# Altium schematic sheet Schematic_Ledtraitim.SchDoc
size A; SheetNumber: 1; SheetTotal: 1
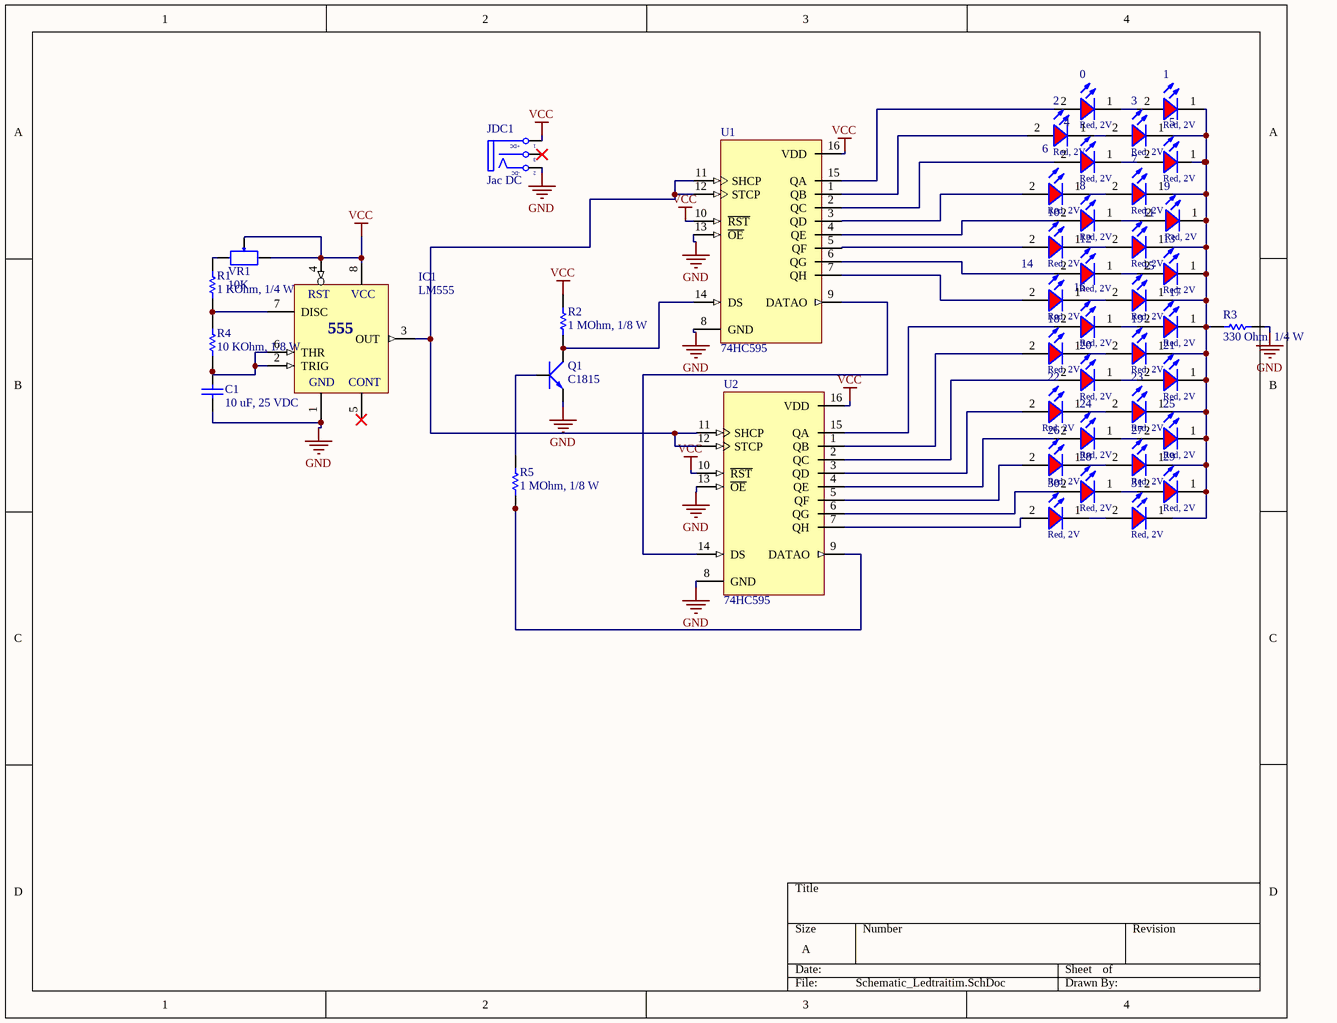
[diagram p0: Schematic_Ledtraitim.SchDoc]

## Parts
0  Red, 2V  [WL-SMCW_0805]
1  Red, 2V  [WL-SMCW_0805]
2  Red, 2V  [WL-SMCW_0805]
3  Red, 2V  [WL-SMCW_0805]
4  Red, 2V  [WL-SMCW_0805]
5  Red, 2V  [WL-SMCW_0805]
6  Red, 2V  [WL-SMCW_0805]
7  Red, 2V  [WL-SMCW_0805]
8  Red, 2V  [WL-SMCW_0805]
9  Red, 2V  [WL-SMCW_0805]
10  Red, 2V  [WL-SMCW_0805]
11  Red, 2V  [WL-SMCW_0805]
12  Red, 2V  [WL-SMCW_0805]
13  Red, 2V  [WL-SMCW_0805]
14  Red, 2V  [WL-SMCW_0805]
15  Red, 2V  [WL-SMCW_0805]
16  Red, 2V  [WL-SMCW_0805]
17  Red, 2V  [WL-SMCW_0805]
18  Red, 2V  [WL-SMCW_0805]
19  Red, 2V  [WL-SMCW_0805]
20  Red, 2V  [WL-SMCW_0805]
21  Red, 2V  [WL-SMCW_0805]
22  Red, 2V  [WL-SMCW_0805]
23  Red, 2V  [WL-SMCW_0805]
24  Red, 2V  [WL-SMCW_0805]
25  Red, 2V  [WL-SMCW_0805]
26  Red, 2V  [WL-SMCW_0805]
27  Red, 2V  [WL-SMCW_0805]
28  Red, 2V  [WL-SMCW_0805]
29  Red, 2V  [WL-SMCW_0805]
30  Red, 2V  [WL-SMCW_0805]
31  Red, 2V  [WL-SMCW_0805]
C1  10 uF, 25 VDC  [CAP_0805]
IC1  LM555  [DIP8]
JDC1  Jac DC  [DC-IN]
Q1  C1815  [TO126]
R1  1 KOhm, 1/4 W  [resistor_0603]
R2  1 MOhm, 1/8 W  [RESISTOR_0805]
R3  330 Ohm, 1/4 W  [resistor_0603]
R4  10 KOhm, 1/8 W  [RESISTOR_0805]
R5  1 MOhm, 1/8 W  [RESISTOR_0805]
U1  74HC595  [DIP16]
U2  74HC595  [DIP16]
VR1  10K  [VOL_1]

## Nets
GND: C1.1 IC1.1(GND) JDC1.2(TN) Q1.3(E) R3.2 U1.8(GND) U1.13(~{OE}) U2.8(GND) U2.13(~{OE})
VCC: IC1.4(RST) IC1.8(VCC) JDC1.1(T) R2.2 U1.10(~{RST}) U1.16(VDD) U2.10(~{RST}) U2.16(VDD) VR1.2 VR1.3
Net0_1: 0.1(K) 1.2(A)
Net0_2: 0.2(A) U1.15(QA)
Net1_1: 1.1(K) 3.1(K) 5.1(K) 7.1(K) 9.1(K) 11.1(K) 13.1(K) 15.1(K) 17.1(K) 19.1(K) 21.1(K) 23.1(K) 25.1(K) 27.1(K) 29.1(K) 31.1(K) R3.1
Net2_1: 2.1(K) 3.2(A)
Net2_2: 2.2(A) U1.1(QB)
Net4_1: 4.1(K) 5.2(A)
Net4_2: 4.2(A) U1.2(QC)
Net6_1: 6.1(K) 7.2(A)
Net6_2: 6.2(A) U1.3(QD)
Net8_1: 8.1(K) 9.2(A)
Net8_2: 8.2(A) U1.4(QE)
Net10_1: 10.1(K) 11.2(A)
Net10_2: 10.2(A) U1.5(QF)
Net12_1: 12.1(K) 13.2(A)
Net12_2: 12.2(A) U1.6(QG)
Net14_1: 14.1(K) 15.2(A)
Net14_2: 14.2(A) U1.7(QH)
Net16_1: 16.1(K) 17.2(A)
Net16_2: 16.2(A) U2.15(QA)
Net18_1: 18.1(K) 19.2(A)
Net18_2: 18.2(A) U2.1(QB)
Net20_1: 20.1(K) 21.2(A)
Net20_2: 20.2(A) U2.2(QC)
Net22_1: 22.1(K) 23.2(A)
Net22_2: 22.2(A) U2.3(QD)
Net24_1: 24.1(K) 25.2(A)
Net24_2: 24.2(A) U2.4(QE)
Net26_1: 26.1(K) 27.2(A)
Net26_2: 26.2(A) U2.5(QF)
Net28_1: 28.1(K) 29.2(A)
Net28_2: 28.2(A) U2.6(QG)
Net30_1: 30.1(K) 31.2(A)
Net30_2: 30.2(A) U2.7(QH)
NetC1_2: C1.2 IC1.2(TRIG) IC1.6(THR) R4.1
NetIC1_3: IC1.3(OUT) U1.11(SHCP) U1.12(STCP) U2.11(SHCP) U2.12(STCP)
NetIC1_7: IC1.7(DISC) R1.1 R4.2
NetQ1_1: Q1.1(B) R5.2
NetQ1_2: Q1.2(C) R2.1 U1.14(DS)
NetR1_2: R1.2 VR1.1
NetR5_1: R5.1 U2.9(DATAO)
NetU1_9: U1.9(DATAO) U2.14(DS)

Not connected (* = marked no-connect by the designer): IC1 5(CONT)*; JDC1 3(S)*

## Notes on the sheet
- (in symbol DCIN) +DC; -DC
- (in symbol LM555) 555

## Library data of the parts
0-31 = 160805RedBlur: WL-SMCW SMT Mono-color Chip LED Blur, size 0805, Red, 2V, 140deg; Color: Red; Size: 0603; Type: Blur; ComponentLink1Description: Datasheet link; ComponentLink1URL: N/A; ComponentLink2Description: Supplier 1 URL; ComponentLink2URL: https://www.mouser.vn/ProductDetail/ams-OSRAM/LS-R976-NR-1?qs=K5ta8V%252BWhtZhvCAe1sTZFg%3D%3D; ComponentLink3Description: Supplier 2 URL; ComponentLink3URL: https://www.digikey.com/en/products/detail/lumex-opto-components-inc/SML-LXT0805IW-TR/304365; ComponentLink4Description: Supplier 3 URL; ComponentLink4URL: N/A; Supplier 1 Name: Mouser; Supplier 1 SN: 720-LSR976-NR-1; Supplier 1 URL: https://www.mouser.vn/ProductDetail/ams-OSRAM/LS-R976-NR-1?qs=K5ta8V%252BWhtZhvCAe1sTZFg%3D%3D; Supplier 2 Name: Digi-Key; Supplier 2 SN: 67-1552-2-ND; Supplier 2 URL: https://www.digikey.com/en/products/detail/lumex-opto-components-inc/SML-LXT0805IW-TR/304365; Supplier 3 Name: ICDayRoi; Supplier 3 SN: N/A; Supplier 3 URL: N/A; Value: Red, 2V
C1 = 0108051061025: CAP, size 0805, 10 uF, 25 VDC; Manufacture Name: TDK; Manufacture SN: CGA4J1X7S1E106K125AE; Capacitance: 10 uF; Tolerance: +/-10%; Voltage Rating DC: 25 VDC; ComponentLink2Description: Datasheet; ComponentLink2URL: https://product.tdk.com/system/files/dam/doc/product/capacitor/ceramic/mlcc/catalog/mlcc_automotive_soft_en.pdf?ref_disty=mouser; Operating Temperature: -55 to +125degC; Packaging: Tape and Reel; Mounting Technology: SMT; Size: 0805; Supplier 1 Name: Mouser; Supplier 1 SN: 810-CGA4J1X7S1E106K2; Supplier 1 URL: https://www.mouser.vn/ProductDetail/TDK/CGA4J1X7S1E106K125AE?qs=PqoDHHvF64%252BJvhmUzM2odA%3D%3D&utm_source=mouser-refine-download&utm_medium=file&utm_campaign=CGA4J1X7S1E106K125AE&utm_content=TDK; Supplier 2 Name: Digi-Key; Supplier 2 SN: 445-181411-2-ND; Supplier 2 URL: https://www.digikey.com/en/products/detail/tdk-corporation/cga4j1x7s1e106k125ae/9744777; Supplier 3 Name: thegioiic; Supplier 3 SN: OEM; Supplier 3 URL: N/A; Value: 10 uF, 25 VDC
IC1 = LM555: Timer Circuits; Value: LM555
JDC1 = DCIN: Jac DC input; Value: Jac DC
Q1 = C1815: NPN 600mW, ECB; Value: C1815
R1 = 0006031021: RES, size 0603, 1 KOhm, 1/4 W; Manufacture  Name: OEM; Resistance: 1 KOhm; Rated Power: 1/4 W; Resistance Tolerance: +/-1%; Size: 0603; Mounting Technology: SMT; Supplier 1 Name: Mouser; Supplier 1 SN: 71-RCS06031K00FKEA; Supplier 2 Name: Digi-Key; Supplier 2 SN: YAG5829TR-ND YAG5829CT-ND YAG5829DKR-ND; Supplier 1 URL: https://www.mouser.vn/ProductDetail/Vishay-Dale/RCS06031K00FKEA?qs=sGAEpiMZZMvdGkrng054t9clqp6gtJJdzI9PGMrTQi4RTIuHToNahw%3D%3D; Supplier 3 Name: thegioiic; Supplier 3 SN: N/A; Supplier 3 URL: N/A; Manufacture  SN: OEM; Value: 1 KOhm, 1/4 W; ComponentLink1Description: Datasheet link; ComponentLink1URL: https://www.yageo.com/upload/media/product/productsearch/datasheet/rchip/PYu-SR_20105_RoHS_L_10.pdf; ComponentLink2Description: Supplier 1 URL; ComponentLink2URL: N/A; ComponentLink3Description: Supplier 2 URL; ComponentLink3URL: https://www.digikey.com/en/products/detail/yageo/SR0603FR-7T1KL/9373103; ComponentLink4Description: Supplier 3 URL; ComponentLink4URL: N/A; Supplier 2 URL: https://www.digikey.com/en/products/detail/yageo/SR0603FR-7T1KL/9373103
R2 R5 = 0008051055: RES, size 0805, 1 MOhm, 1/8 W; Manufacture  Name: Vishay Dale; Manufacture  SN: CRCW08051M00JNEAC; Resistance tolerance: +/-5%; Rated Power: 1/8 W; Resistance: 1 MOhm; Size: 0805; Mounting Technology: SMT; Supplier 1 Name: Mouser; Supplier 1 SN: 71-CRCW0805J-1M-E3; Supplier 1 URL: https://www.mouser.vn/ProductDetail/Vishay-Dale/CRCW08051M00JNEA?qs=1CkV0QOCgMqcQMPfmcgFvg%3D%3D; Supplier 2 Name: Digi-Key; Supplier 2 SN: 541-CRCW08051M00JNEACTR-ND; Supplier 2 URL: https://www.digikey.com/en/products/detail/vishay-dale/CRCW08051M00JNEAC/7923683; Supplier 3 Name: Thegioiic; Supplier 3 SN: N/A; Supplier 3 URL: https://www.thegioiic.com/dien-tro-1-mohm-0805-5; Value: 1 MOhm, 1/8 W; ComponentLink1Description: Datasheet link; ComponentLink1URL: https://www.vishay.com/docs/28773/crcwce3.pdf; ComponentLink2Description: Supplier 1 URL; ComponentLink2URL: https://www.mouser.vn/ProductDetail/Vishay-Dale/CRCW08051M00JNEA?qs=1CkV0QOCgMqcQMPfmcgFvg%3D%3D; ComponentLink3Description: Supplier 2 URL; ComponentLink3URL: https://www.digikey.com/en/products/detail/vishay-dale/CRCW08051M00JNEAC/7923683; ComponentLink4Description: Supplier 3 URL; ComponentLink4URL: https://www.thegioiic.com/dien-tro-1-mohm-0805-5
R3 = 0006033311: RES, size 0603, 330 Ohm, 1/4 W; Manufacture  Name: OEM; Resistance: 330 Ohm; Rated Power: 1/4 W; Resistance Tolerance: +/-1%; Size: 0603; Mounting Technology: SMT; Supplier 1 Name: Mouser; Supplier 1 SN: 667-ERJ-UP3F3300V; Supplier 2 Name: Digi-Key; Supplier 2 SN: 10-ERJ-UP3F3300VTR-ND 10-ERJ-UP3F3300VCT-ND 10-ERJ-UP3F3300VDKR-ND; Supplier 1 URL: https://www.mouser.vn/ProductDetail/Panasonic/ERJ-UP3F3300V?qs=sGAEpiMZZMvdGkrng054twq3eZrCFN89MDZusw5Tf7mZnfRSpxxqIA%3D%3D; Supplier 3 Name: thegioiic; Supplier 3 SN: N/A; Supplier 3 URL: N/A; Manufacture  SN: OEM; Value: 330 Ohm, 1/4 W; ComponentLink1Description: Datasheet link; ComponentLink1URL: https://api.pim.na.industrial.panasonic.com/file_stream/main/fileversion/4484; ComponentLink2Description: Supplier 1 URL; ComponentLink2URL: N/A; ComponentLink3Description: Supplier 2 URL; ComponentLink3URL: https://www.digikey.com/en/products/detail/panasonic-electronic-components/ERJ-UP3F3300V/12093106; ComponentLink4Description: Supplier 3 URL; ComponentLink4URL: N/A; Supplier 2 URL: https://www.digikey.com/en/products/detail/panasonic-electronic-components/ERJ-UP3F3300V/12093106
R4 = 0008051035: RES, size 0805, 10 KOhm, 1/8 W; Manufacture  Name: Vishay Dale; Manufacture  SN: CRCW080510K0JNEAC; Resistance tolerance: +/-5%; Rated Power: 1/8 W; Resistance: 10 KOhm; Size: 0805; Mounting Technology: SMT; Supplier 1 Name: Mouser; Supplier 1 SN: 71-CRCW080510K0JNEB; Supplier 1 URL: https://www.mouser.vn/ProductDetail/Vishay-Dale/CRCW080510K0JNEB?qs=LOX6nxTstiZ5fn9YUdHx5A%3D%3D; Supplier 2 Name: Digi-Key; Supplier 2 SN: 541-4163-2-ND; Supplier 2 URL: https://www.digikey.com/en/products/detail/vishay-dale/CRCW080510K0JNEAC/7928585; Supplier 3 Name: Thegioiic; Supplier 3 SN: N/A; Supplier 3 URL: N/A; Value: 10 KOhm, 1/8 W; ComponentLink1Description: Datasheet link; ComponentLink1URL: https://www.vishay.com/docs/28773/crcwce3.pdf; ComponentLink2Description: Supplier 1 URL; ComponentLink2URL: https://www.mouser.vn/ProductDetail/Vishay-Dale/CRCW080510K0JNEB?qs=LOX6nxTstiZ5fn9YUdHx5A%3D%3D; ComponentLink3Description: Supplier 2 URL; ComponentLink3URL: https://www.digikey.com/en/products/detail/vishay-dale/CRCW080510K0JNEAC/7928585; ComponentLink4Description: Supplier 3 URL; ComponentLink4URL: N/A
U1 U2 = 74HC595: 8-Bit Serial-Input/Serial or Prallel-Output Shift Register with Latched 3-State Outputs; Published: 15-Apr-2002; DatasheetVersion: Mar-2000; PackageVersion: Apr-2000; PackageReference: 648-08; Publisher: Altium Limited; PackageDescription: DIP; 16 Leads; Row Spacing 7.62 mm; Pitch 2.54 mm; Code_JEDEC: MS-001-BB; ComponentLink1Description: Manufacturer Link; ComponentLink1URL: http://www.onsemi.com/; ComponentLink2Description: Datasheet; ComponentLink2URL: http://www.onsemi.com/pub/Collateral/MC74HC595A-D.PDF
VR1 = Var Resitor: Var Resistor; Value: VR 10K